# Altium schematic sheet Power_Discrete - Core.SchDoc: Power Discrete - Core
size A3; Date: Not used; ApprovedBy: Not used; CheckedBy: Not used; Author: Not used; CompanyName: STMicroelectronics; DrawnBy: Not used; Engineer: Not used; Organization: Not used; Address1: Not used; Address2: Not used; Address3: Not used; Address4: Not used; DocumentNumber: Not used; Revision: Not used; SheetNumber: 4; SheetTotal: 19; CurrentTime: Not used; CurrentDate: Not used; Time: Not used; DocumentFullPathAndName: Not used; DocumentName: Not used; ModifiedDate: Not used; ImagePath: Not used; ProjectName: Not used; Application_BuildNumber: Not used
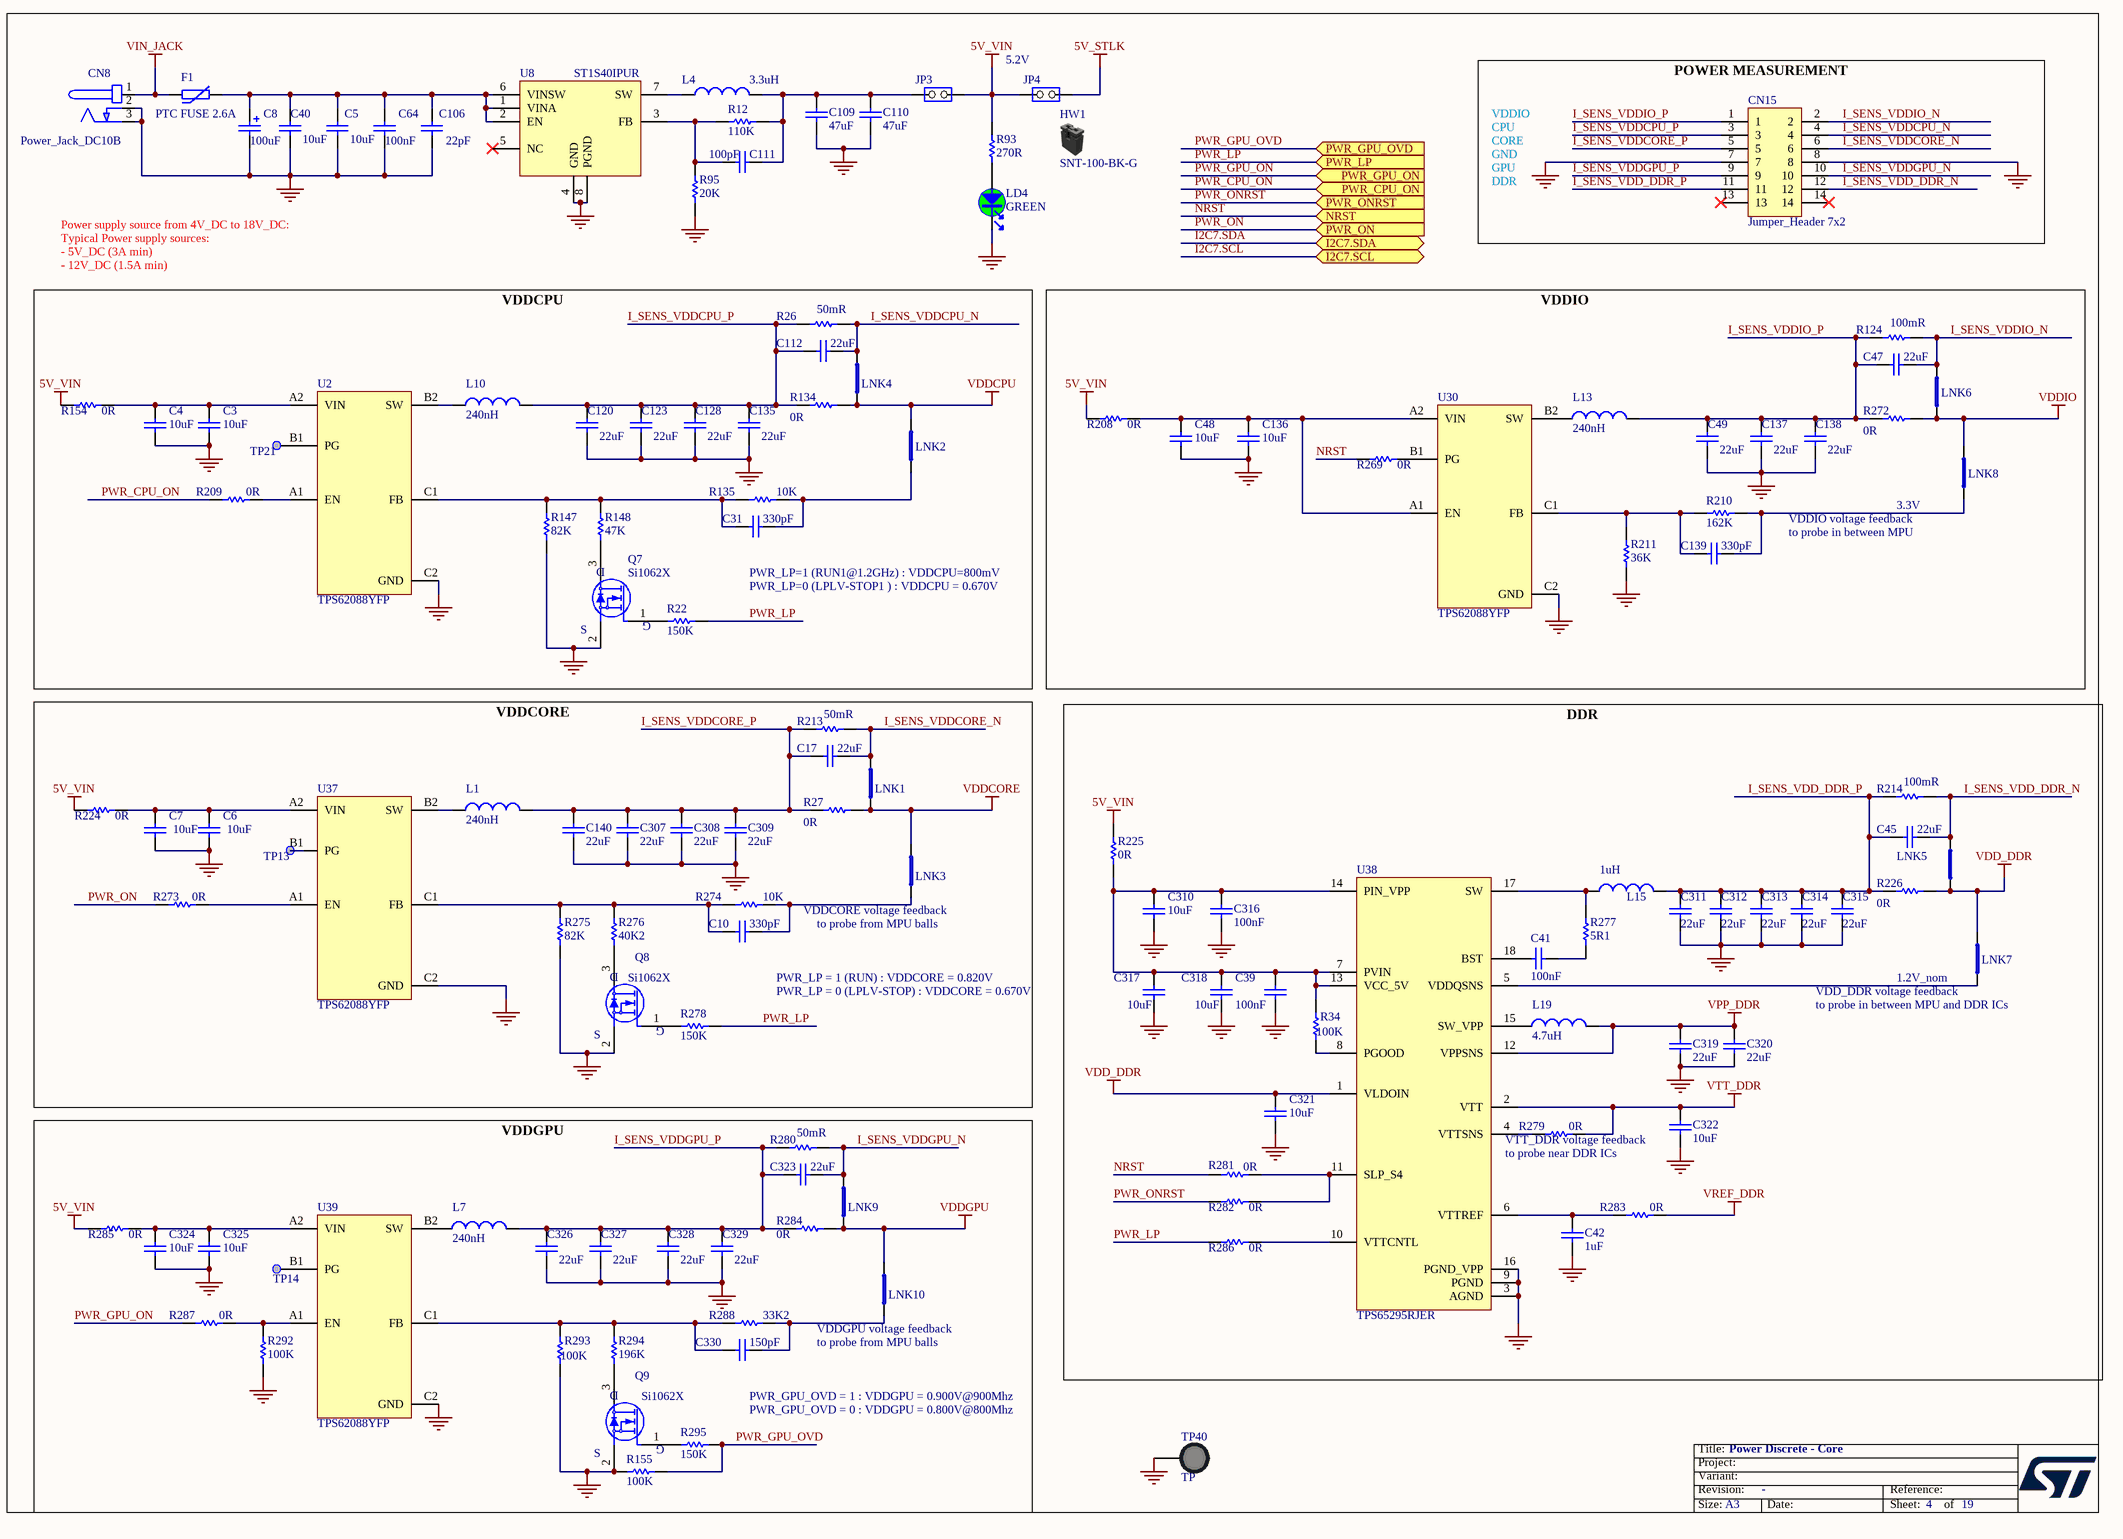
[diagram p0: Power_Discrete - Core.SchDoc]

## Parts
C3  value 10uF  [C0603]  (hidden comment: Capacitor)
C4  value 10uF  [C0603]  (hidden comment: Capacitor)
C5  value 10uF  [C0805]  (hidden comment: Capacitor)
C6  value 10uF  [C0603]  (hidden comment: Capacitor)
C7  value 10uF  [C0603]  (hidden comment: Capacitor)
C8  value 100uF  [CPOL_WURTH_WCAP-ASLL_8X10P5]  (hidden comment: Cap_POL_TANA)
C10  value 330pF  [C0402]  (hidden comment: Capacitor)
C17  value 22uF  [C0603]  (hidden comment: Capacitor)
C31  value 330pF  [C0402]  (hidden comment: Capacitor)
C39  value 100nF  [C0402]  (hidden comment: Capacitor)
C40  value 10uF  [C0805]  (hidden comment: Capacitor)
C41  value 100nF  [C0402]  (hidden comment: Capacitor)
C42  value 1uF  [C0402]  (hidden comment: Capacitor)
C45  value 22uF  [C0603]  (hidden comment: Capacitor)
C47  value 22uF  [C0603]  (hidden comment: Capacitor)
C48  value 10uF  [C0603]  (hidden comment: Capacitor)
C49  value 22uF  [C0603]  (hidden comment: Capacitor)
C64  value 100nF  [C0805_H0P85]  (hidden comment: Capacitor)
C106  value 22pF  [C0402]  (hidden comment: Capacitor)
C109  value 47uF  [C0805]  (hidden comment: Capacitor)
C110  value 47uF  [C0805]  (hidden comment: Capacitor)
C111  value 100pF  [C0402]  (hidden comment: Capacitor)
C112  value 22uF  [C0603]  (hidden comment: Capacitor)
C120  value 22uF  [C0603]  (hidden comment: Capacitor)
C123  value 22uF  [C0603]  (hidden comment: Capacitor)
C128  value 22uF  [C0603]  (hidden comment: Capacitor)
C135  value 22uF  [C0603]  (hidden comment: Capacitor)
C136  value 10uF  [C0603]  (hidden comment: Capacitor)
C137  value 22uF  [C0603]  (hidden comment: Capacitor)
C138  value 22uF  [C0603]  (hidden comment: Capacitor)
C139  value 330pF  [C0402]  (hidden comment: Capacitor)
C140  value 22uF  [C0603]  (hidden comment: Capacitor)
C307  value 22uF  [C0603]  (hidden comment: Capacitor)
C308  value 22uF  [C0603]  (hidden comment: Capacitor)
C309  value 22uF  [C0603]  (hidden comment: Capacitor)
C310  value 10uF  [C0603]  (hidden comment: Capacitor)
C311  value 22uF  [C0603]  (hidden comment: Capacitor)
C312  value 22uF  [C0603]  (hidden comment: Capacitor)
C313  value 22uF  [C0603]  (hidden comment: Capacitor)
C314  value 22uF  [C0603]  (hidden comment: Capacitor)
C315  value 22uF  [C0603]  (hidden comment: Capacitor)
C316  value 100nF  [C0402]  (hidden comment: Capacitor)
C317  value 10uF  [C0603]  (hidden comment: Capacitor)
C318  value 10uF  [C0603]  (hidden comment: Capacitor)
C319  value 22uF  [C0603]  (hidden comment: Capacitor)
C320  value 22uF  [C0603]  (hidden comment: Capacitor)
C321  value 10uF  [C0603]  (hidden comment: Capacitor)
C322  value 10uF  [C0603]  (hidden comment: Capacitor)
C323  value 22uF  [C0603]  (hidden comment: Capacitor)
C324  value 10uF  [C0603]  (hidden comment: Capacitor)
C325  value 10uF  [C0603]  (hidden comment: Capacitor)
C326  value 22uF  [C0603]  (hidden comment: Capacitor)
C327  value 22uF  [C0603]  (hidden comment: Capacitor)
C328  value 22uF  [C0603]  (hidden comment: Capacitor)
C329  value 22uF  [C0603]  (hidden comment: Capacitor)
C330  value 150pF  [C0402]  (hidden comment: Capacitor)
CN8  Power_Jack_DC10B  [CON_DC-POWER-SOCKET_CLIFF_FC68149_DC10B]
CN15  value Jumper_Header 7x2  [CON_SAMTEC_TSW-107-07-X-D]  (hidden comment: Header 7x2)
F1  value PTC FUSE 2.6A  [PTC_BEL-FUSE_1812_0ZCG0260FF2C]  (hidden comment: 0ZCG0260FF2C)
HW1  value SNT-100-BK-G  (hidden comment: Shunt Black 2.54mm)  (mechanical)
JP3  Jumper_Header 2x1  [CON_SAMTEC_TSW-102-07-G-S]  (value not drawn)
JP4  Jumper_Header 2x1  [CON_SAMTEC_TSW-102-07-G-S]  (value not drawn)
L1  value 240nH  [IND_MURATA_DFE201612P]  (hidden comment: Inductor)
L4  value 3.3uH  [IND_5040_WURTH_74404054033]  (hidden comment: Inductor)
L7  value 240nH  [IND_MURATA_DFE201612P]  (hidden comment: Inductor)
L10  value 240nH  [IND_MURATA_DFE201612P]  (hidden comment: Inductor)
L13  value 240nH  [IND_MURATA_DFE201612P]  (hidden comment: Inductor)
L15  value 1uH  [IND_4025_WURTH_74404043010A]  (hidden comment: Inductor)
L19  value 4.7uH  [IND_4025_WURTH_74404043047A]  (hidden comment: Inductor)
LD4  value GREEN  [LED_0603_OSRAM_LG-Q396-PS-35_GREEN_1A2K_H0P4]  (hidden comment: LED_green)
LNK1  link_200  [LINK200]  (value not drawn)  (no BOM)
LNK2  link_200  [LINK200]  (value not drawn)  (no BOM)
LNK3  link_200  [LINK200]  (value not drawn)  (no BOM)
LNK4  link_200  [LINK200]  (value not drawn)  (no BOM)
LNK5  link_200  [LINK200]  (value not drawn)  (no BOM)
LNK6  link_200  [LINK200]  (value not drawn)  (no BOM)
LNK7  link_200  [LINK200]  (value not drawn)  (no BOM)
LNK8  link_200  [LINK200]  (value not drawn)  (no BOM)
LNK9  link_200  [LINK200]  (value not drawn)  (no BOM)
LNK10  link_200  [LINK200]  (value not drawn)  (no BOM)
Q7  value Si1062X  [MOS_SC89-3L]  (hidden comment: MOSFET_N-CHANNEL)
Q8  value Si1062X  [MOS_SC89-3L]  (hidden comment: MOSFET_N-CHANNEL)
Q9  value Si1062X  [MOS_SC89-3L]  (hidden comment: MOSFET_N-CHANNEL)
R12  value 110K  [R0402]  (hidden comment: Resistor)
R22  value 150K  [R0402]  (hidden comment: Resistor)
R26  value 50mR  [R0603]  (hidden comment: Resistor)
R27  value 0R  [R0603]  (hidden comment: Resistor)
R34  value 100K  [R0402]  (hidden comment: Resistor)
R93  value 270R  [R0402]  (hidden comment: Resistor)
R95  value 20K  [R0402]  (hidden comment: Resistor)
R124  value 100mR  [R0603]  (hidden comment: Resistor)
R134  value 0R  [R0603]  (hidden comment: Resistor)
R135  value 10K  [R0402]  (hidden comment: Resistor)
R147  value 82K  [R0402]  (hidden comment: Resistor)
R148  value 47K  [R0402]  (hidden comment: Resistor)
R154  value 0R  [R0603]  (hidden comment: Resistor)
R155  value 100K  [R0402]  (hidden comment: Resistor)
R208  value 0R  [R0603]  (hidden comment: Resistor)
R209  value 0R  [R0402]  (hidden comment: Resistor)
R210  value 162K  [R0402]  (hidden comment: Resistor)
R211  value 36K  [R0402]  (hidden comment: Resistor)
R213  value 50mR  [R0603]  (hidden comment: Resistor)
R214  value 100mR  [R0603]  (hidden comment: Resistor)
R224  value 0R  [R0603]  (hidden comment: Resistor)
R225  value 0R  [R0603]  (hidden comment: Resistor)
R226  value 0R  [R0603]  (hidden comment: Resistor)
R269  value 0R  [R0603]  (hidden comment: Resistor)
R272  value 0R  [R0603]  (hidden comment: Resistor)
R273  value 0R  [R0402]  (hidden comment: Resistor)
R274  value 10K  [R0402]  (hidden comment: Resistor)
R275  value 82K  [R0402]  (hidden comment: Resistor)
R276  value 40K2  [R0402]  (hidden comment: Resistor)
R277  value 5R1  [R0402]  (hidden comment: Resistor)
R278  value 150K  [R0402]  (hidden comment: Resistor)
R279  value 0R  [R0402]  (hidden comment: Resistor)
R280  value 50mR  [R0603]  (hidden comment: Resistor)
R281  value 0R  [R0402]  (hidden comment: Resistor)
R282  value 0R  [R0402]  (hidden comment: Resistor)
R283  value 0R  [R0402]  (hidden comment: Resistor)
R284  value 0R  [R0603]  (hidden comment: Resistor)
R285  value 0R  [R0603]  (hidden comment: Resistor)
R286  value 0R  [R0402]  (hidden comment: Resistor)
R287  value 0R  [R0402]  (hidden comment: Resistor)
R288  value 33K2  [R0402]  (hidden comment: Resistor)
R292  value 100K  [R0402]  (hidden comment: Resistor)
R293  value 100K  [R0402]  (hidden comment: Resistor)
R294  value 196K  [R0402]  (hidden comment: Resistor)
R295  value 150K  [R0402]  (hidden comment: Resistor)
TP13  Test Point  [TP_SMD_0-6MM]  (value not drawn)  (no BOM)
TP14  Test Point  [TP_SMD_0-6MM]  (value not drawn)  (no BOM)
TP21  Test Point  [TP_SMD_0-6MM]  (value not drawn)  (no BOM)
TP40  value TP  [TP_PTH-1P02MM_TEST-TERMINAL_RS_101-2391_BLACK]  (hidden comment: Test_pin_conn_black)
U2  TPS62088YFP  [ICC_DSBGA6_YFP_0P80X1P20_H0P50_P040]
U8  ST1S40IPUR  [ICC_VFQFPN8-EPAD_4X4_P080]
U30  TPS62088YFP  [ICC_DSBGA6_YFP_0P80X1P20_H0P50_P040]
U37  TPS62088YFP  [ICC_DSBGA6_YFP_0P80X1P20_H0P50_P040]
U38  value TPS65295RJER  [ICC_VQFN18_3X3_P050]  (hidden comment: TPS65295)
U39  TPS62088YFP  [ICC_DSBGA6_YFP_0P80X1P20_H0P50_P040]

## Ports
I2C7.SCL (bidir), I2C7.SDA (bidir), NRST (in), PWR_CPU_ON (in), PWR_GPU_ON (in), PWR_GPU_OVD (in), PWR_LP (in), PWR_ON (in), PWR_ONRST (in)

## Nets
5V_STLK: JP4.1(COMMON)
5V_VIN: JP3.1(COMMON) JP4.2(NO) R93.2 R154.1 R208.1 R224.1 R225.2 R285.1
GND: C3.1 C4.1 C5.1 C6.1 C7.1 C8.2 C39.1 C40.1 C42.2 C48.1 C49.1 C64.1 C106.1 C109.1 C110.1 C120.1 C123.1 C128.1 C135.1 C136.1 C137.1 C138.1 C140.1 C307.1 C308.1 C309.1 C310.1 C311.1 C312.1 C313.1 C314.1 C315.1 C316.1 C317.1 C318.1 C319.1 C320.1 C321.1 C322.1 C324.1 C325.1 C326.1 C327.1 C328.1 C329.1 CN8.2 CN8.3 CN15.7 CN15.8 LD4.2 Q7.2(S) Q8.2(S) Q9.2(S) R95.1 R147.1 R155.2 R211.1 R275.1 R292.1 R293.1 TP40.1 U2.C2(GND) U8.4(GND) U8.8(PGND) U30.C2(GND) U37.C2(GND) U38.3(AGND) U38.9(PGND) U38.16(PGND_VPP) U39.C2(GND)
VDD_DDR: C321.2 LNK5.2 LNK7.2 R226.2 U38.1(VLDOIN)
VDDCORE: LNK1.1 LNK3.2 R27.2
VDDCPU: LNK2.1 LNK4.1 R134.2
VDDGPU: LNK9.1 LNK10.2 R284.2
VDDIO: LNK6.2 LNK8.2 R272.2
VIN_JACK: CN8.1 F1.1
VPP_DDR: C319.2 C320.2 L19.2 U38.12(VPPSNS)
VREF_DDR: R283.2
VTT_DDR: C322.2 R279.2 U38.2(VTT)
I2C7.SCL: port I2C7.SCL
I2C7.SDA: port I2C7.SDA
I_SENS_VDD_DDR_N: C45.1 CN15.12 LNK5.1 R214.2
I_SENS_VDD_DDR_P: C45.2 C311.2 C312.2 C313.2 C314.2 C315.2 CN15.11 L15.2 R214.1 R226.1
I_SENS_VDDCORE_N: C17.1 CN15.6 LNK1.2 R213.2
I_SENS_VDDCORE_P: C17.2 C140.2 C307.2 C308.2 C309.2 CN15.5 L1.2 R27.1 R213.1
I_SENS_VDDCPU_N: C112.1 CN15.4 LNK4.2 R26.2
I_SENS_VDDCPU_P: C112.2 C120.2 C123.2 C128.2 C135.2 CN15.3 L10.2 R26.1 R134.1
I_SENS_VDDGPU_N: C323.1 CN15.10 LNK9.2 R280.2
I_SENS_VDDGPU_P: C323.2 C326.2 C327.2 C328.2 C329.2 CN15.9 L7.2 R280.1 R284.1
I_SENS_VDDIO_N: C47.1 CN15.2 LNK6.1 R124.2
I_SENS_VDDIO_P: C47.2 C49.2 C137.2 C138.2 CN15.1 L13.2 R124.1 R272.1
NRST: R269.1 R281.1 ; port NRST
PWR_CPU_ON: R209.1 ; port PWR_CPU_ON
PWR_GPU_ON: R287.1 ; port PWR_GPU_ON
PWR_GPU_OVD: R155.1 R295.1 ; port PWR_GPU_OVD
PWR_LP: R22.1 R278.1 R286.1 ; port PWR_LP
PWR_ON: R273.1 ; port PWR_ON
PWR_ONRST: R282.1 ; port PWR_ONRST
NetC3_2: C3.2 C4.2 R154.2 U2.A2(VIN)
NetC5_2: C5.2 C8.1 C40.2 C64.2 C106.2 F1.2 U8.1(VINA) U8.2(EN) U8.6(VINSW)
NetC6_2: C6.2 C7.2 R224.2 U37.A2(VIN)
NetC10_1: C10.1 R274.1 R275.2 R276.2 U37.C1(FB)
NetC10_2: C10.2 LNK3.1 R274.2
NetC31_1: C31.1 R135.1 R147.2 R148.2 U2.C1(FB)
NetC31_2: C31.2 LNK2.2 R135.2
NetC39_2: C39.2 C310.2 C316.2 C317.2 C318.2 R34.2 R225.1 U38.7(PVIN) U38.13(VCC_5V) U38.14(PIN_VPP)
NetC41_1: C41.1 U38.18(BST)
NetC41_2: C41.2 R277.1
NetC42_1: C42.1 R283.1 U38.6(VTTREF)
NetC48_2: C48.2 C136.2 R208.2 U30.A1(EN) U30.A2(VIN)
NetC109_2: C109.2 C110.2 C111.1 JP3.2(NO) L4.2 R12.1
NetC111_2: C111.2 R12.2 R95.2 U8.3(FB)
NetC139_1: C139.1 R210.1 R211.2 U30.C1(FB)
NetC139_2: C139.2 LNK8.1 R210.2
NetC324_2: C324.2 C325.2 R285.2 U39.A2(VIN)
NetC330_1: C330.1 R288.1 R293.2 R294.2 U39.C1(FB)
NetC330_2: C330.2 LNK10.1 R288.2
NetL1_1: L1.1 U37.B2(SW)
NetL4_1: L4.1 U8.7(SW)
NetL7_1: L7.1 U39.B2(SW)
NetL10_1: L10.1 U2.B2(SW)
NetL13_1: L13.1 U30.B2(SW)
NetL15_1: L15.1 R277.2 U38.17(SW)
NetL19_1: L19.1 U38.15(SW_VPP)
NetLD4_1: LD4.1 R93.1
NetLNK7_1: LNK7.1 U38.5(VDDQSNS)
NetQ7_1: Q7.1(G) R22.2
NetQ7_3: Q7.3(D) R148.1
NetQ8_1: Q8.1(G) R278.2
NetQ8_3: Q8.3(D) R276.1
NetQ9_1: Q9.1(G) R295.2
NetQ9_3: Q9.3(D) R294.1
NetR34_1: R34.1 U38.8(PGOOD)
NetR209_2: R209.2 U2.A1(EN)
NetR269_2: R269.2 U30.B1(PG)
NetR273_2: R273.2 U37.A1(EN)
NetR279_1: R279.1 U38.4(VTTSNS)
NetR281_2: R281.2 R282.2 U38.11(SLP_S4)
NetR286_2: R286.2 U38.10(VTTCNTL)
NetR287_2: R287.2 R292.2 U39.A1(EN)
NetTP13_1: TP13.1 U37.B1(PG)
NetTP14_1: TP14.1 U39.B1(PG)
NetTP21_1: TP21.1 U2.B1(PG)

Not connected (* = marked no-connect by the designer): CN15 13* 14*; U8 5(NC)*

## Notes on the sheet
- (near JP4) 5.2V
- VDDIO
- CPU
- GND
- DDR
- CORE
- GPU
- (near CN15) POWER MEASUREMENT
- Power supply source from 4V_DC to 18V_DC:
  Typical Power supply sources:
  - 5V_DC (3A min)
  - 12V_DC (1.5A min)
- VDDIO voltage feedback
- (near LNK8) 3.3V
- (near C31) PWR_LP=1 (RUN1@1.2GHz) : VDDCPU=800mV
- PWR_LP=0 (LPLV-STOP1 ) : VDDCPU = 0.670V
- to probe in between MPU
- VDDCPU
- (near LNK3) VDDCORE voltage feedback
- (near LNK3) to probe from MPU balls
- PWR_LP = 1 (RUN) : VDDCORE = 0.820V
- PWR_LP = 0 (LPLV-STOP) : VDDCORE = 0.670V
- (near LNK7) VDD_DDR voltage feedback
- (near LNK7) 1.2V_nom
- (near LNK7) to probe in between MPU and DDR ICs
- VDDCORE
- (near R279) VTT_DDR voltage feedback
- to probe near DDR ICs
- (near LNK10) VDDGPU voltage feedback
- PWR_GPU_OVD = 1 : VDDGPU = 0.900V@900Mhz
- (near LNK10) to probe from MPU balls
- PWR_GPU_OVD = 0 : VDDGPU = 0.800V@800Mhz
- VDDGPU
- Title:
- Project:
- Size:
- Revision:
- Variant:
- A3
- -
- Date:
- Reference:
- Sheet:
- of

## Library data of the parts
C3 C4 C6 C7 C48 C136 C310 C317 C318 C321 C322 C324 C325 = MCD-00099: Capacitor, MLCC, 10uF, 10V, X5R, +/-10%, 0603, T=0,8mm; Manufacturer_Part_Number: GRM188R61A106KE69D; Manufacturer: MURATA; Part_Preference: Recommended; Order_Code_RS: 170-6168; ID: 2770; ShowFields: YES; Internal_Part_Number: MCD-00099; Status: Released; Part_Type: Capacitor; Package: 0603; ComponentLink1Description: Part_Information; ComponentLink1URL: http://tunmcdsvn.tun.st.com/Component_Documentation_Library/Trunk/Capacitor/MURATA_GRM_Series; Order_Code_Digikey: 490-10474-1-ND; Order_Code_Farnell: 2494233; Alternate_Manufacturer: N/A; Alternate_Manufacturer_Part_Number: N/A
C5 C40 = MCD-00014: Capacitor, MLCC, 10uF, 25V, X5R, +/-10%, 0805, T=0,85mm; Part_Preference: Recommended; Manufacturer: YAGEO; Manufacturer_Part_Number: CC0805KRX5R8BB106; Full_Alternate_Internal_Part_Number: MCD-02385; ID: 2468; ShowFields: YES; Internal_Part_Number: MCD-00014; Status: Released; Part_Type: Capacitor; Package: 0805; ComponentLink1Description: Part_Information; ComponentLink1URL: http://tunmcdsvn.tun.st.com/Component_Documentation_Library/Trunk/Capacitor/YAGEO_X5R_Series; Order_Code_Digikey: 311-3503-1-ND; Order_Code_Farnell: N/A; Order_Code_RS: N/A; Alternate_Manufacturer: N/A; Alternate_Manufacturer_Part_Number: N/A
C8 = MCD-01683: Capacitor,Electrolytic,100uF,35V, 20%, SMT, D=8mm, T=10.5mm; Part_Preference: Recommended; Manufacturer: WURTH ELEKTRONIK; Manufacturer_Part_Number: 865060553006; Order_Code_RS: 839-5753; ID: 3783; ShowFields: YES; Revision: July-2002: Re-released for DXP Platform.; Internal_Part_Number: MCD-01683; Status: Released; Part_Type: Capacitor; Package: 8x10.5mm; ComponentLink1Description: Part_Information; ComponentLink1URL: http://tunmcdsvn.tun.st.com/Component_Documentation_Library/Trunk/Capacitor/WURTH-ELEKTRONIC_ASLL_Series; Order_Code_Digikey: 732-8586-1-ND; Order_Code_Farnell: 2466219; Alternate_Manufacturer: N/A; Alternate_Manufacturer_Part_Number: N/A
C10 C31 C139 = MCD-01579: Capacitor, MLCC, 330pF, 50V, NPO, +/-5%, 0402, T=0.5mm; Part_Preference: Recommended; Manufacturer: YAGEO; Manufacturer_Part_Number: CC0402JRNPO9BN331; ID: 3679; ShowFields: YES; Internal_Part_Number: MCD-01579; Status: Checked; Part_Type: Capacitor; Alternate_Manufacturer: N/A; Alternate_Manufacturer_Part_Number: N/A; Package: 0402; ComponentLink1URL: http://tunmcdsvn.tun.st.com/Component_Documentation_Library/Trunk/Capacitor/YAGEO_NP0_Series; Order_Code_Digikey: 311-1667-1-ND; Order_Code_Farnell: N/A; Order_Code_RS: N/A
C17 C45 C47 C49 C112 C120 C123 C128 C135 C137 C138 C308 C309 C311-C315 C319 C320 C323 C326-C329 = MCD-00100: Capacitor, MLCC, 22uF, 6V3, X5R, +/-20%, 0603, T=0,8mm; Manufacturer_Part_Number: GRM188R60J226MEA0J; Manufacturer: MURATA; Part_Preference: Recommended; ID: 2766; ShowFields: YES; Internal_Part_Number: MCD-00100; Status: Released; Part_Type: Capacitor; Package: 0603; ComponentLink1Description: Part_Information; ComponentLink1URL: http://tunmcdsvn.tun.st.com/Component_Documentation_Library/Trunk/Capacitor/MURATA_GRM_Series; Order_Code_Digikey: 490-7612-2-ND; Order_Code_Farnell: N/A; Order_Code_RS: N/A; Alternate_Manufacturer: N/A; Alternate_Manufacturer_Part_Number: N/A
C39 C41 C316 = MCD-00006: Capacitor, MLCC, 100nF, 16V, X7R, +/-10%, 0402, T=0.5mm; Part_Preference: Recommended; Manufacturer: YAGEO; Manufacturer_Part_Number: CC0402KRX7R7BB104; Alternate_Manufacturer: MURATA; Alternate_Manufacturer_Part_Number: GCM155R71C104KA55D; Order_Code_RS: 616-9701; ID: 2474; ShowFields: YES; Internal_Part_Number: MCD-00006; Status: Released; Part_Type: Capacitor; Package: 0402; ComponentLink1URL: http://tunmcdsvn.tun.st.com/Component_Documentation_Library/Trunk/Capacitor/YAGEO_X7R_Series; Order_Code_Digikey: 311-1338-1-ND; Order_Code_Farnell: 9402047
C42 = MCD-01722: Capacitor, MLCC, 1uF, 10V, X5R, +/-10%, 0402, T=0.5mm; Part_Preference: Recommended; Manufacturer: YAGEO; Manufacturer_Part_Number: CC0402KRX5R6BB105; ID: 3822; ShowFields: YES; Internal_Part_Number: MCD-01722; Status: Released; Part_Type: Capacitor; Alternate_Manufacturer: N/A; Alternate_Manufacturer_Part_Number: N/A; Package: 0402; ComponentLink1URL: http://tunmcdsvn.tun.st.com/Component_Documentation_Library/Trunk/Capacitor/YAGEO_X5R_Series; Order_Code_Digikey: 311-1439-1-ND; Order_Code_Farnell: 1458896; Order_Code_RS: N/A
C64 = MCD-01525: Capacitor, MLCC, 100nF, 50V, X7R, 10%, 0805, T=0,85mm; BMS_Part_Number: 9142249; Part_Preference: Recommended; Manufacturer: YAGEO; Manufacturer_Part_Number: CC0805KRX7R9BB104; Order_Code_RS: 669-8842; ID: 3625; ShowFields: YES; Internal_Part_Number: MCD-01525; Status: Released; Part_Type: Capacitor; Package: 0805; ComponentLink1Description: Part_Information; ComponentLink1URL: http://tunmcdsvn.tun.st.com/Component_Documentation_Library/Trunk/Capacitor/YAGEO_X7R_Series; Order_Code_Digikey: 311-1140-1-ND; Order_Code_Farnell: 3019949; Alternate_Manufacturer: N/A; Alternate_Manufacturer_Part_Number: N/A
C106 = MCD-01995: Capacitor, MLCC, 22pF, 50V, C0G, 5%, 0402, T=0,5mm; Part_Preference: Recommended; Manufacturer: TDK; Manufacturer_Part_Number: C1005NP01H220J050BA; ID: 4095; ShowFields: YES; Internal_Part_Number: MCD-01995; Status: Released; Part_Type: Capacitor; Package: 0402; ComponentLink1Description: Part_Information; ComponentLink1URL: http://tunmcdsvn.tun.st.com/Component_Documentation_Library/Trunk/Capacitor/TDK_C_Series; Order_Code_Digikey: 445-13793-1-ND; Alternate_Manufacturer: N/A; Alternate_Manufacturer_Part_Number: N/A; Order_Code_Farnell: 3416050RL; Order_Code_RS: N/A
C109 C110 = MCD-00204: Capacitor, MLCC, 47uF, 10V, X5R, +/-20%, 0805, T=1,25mm; Part_Preference: Recommended; Manufacturer: MURATA; Manufacturer_Part_Number: GRM21BR61A476ME15K; ID: 2664; ShowFields: YES; Internal_Part_Number: MCD-00204; Status: Checked; Part_Type: Capacitor; Alternate_Manufacturer: N/A; Alternate_Manufacturer_Part_Number: N/A; Package: 0805; ComponentLink1Description: Part_Information; ComponentLink1URL: http://tunmcdsvn.tun.st.com/Component_Documentation_Library/Trunk/Capacitor/MURATA_GRM_Series; Order_Code_Digikey: GRM21BR61A476ME15K-ND; Order_Code_Farnell: N/A; Order_Code_RS: N/A
C111 = MCD-00205: Capacitor,MLCC,100pF,50V,NPO,+/-5%,0402,T=0,5mm; Manufacturer_Part_Number: CC0402JRNPO9BN101; Manufacturer: YAGEO; Part_Preference: Recommended; Fitted: YES; ID: 2658; Internal_Part_Number: MCD-00205; Status: Released; Part_Type: Capacitor; Package: 0402; ComponentLink1Description: Part_Information; ComponentLink1URL: http://tunmcdsvn.tun.st.com/Component_Documentation_Library/Trunk/Capacitor/YAGEO_NP0_Series; Order_Code_Digikey: 311-1024-1-ND; Order_Code_Farnell: 3019226RL; Order_Code_RS: N/A; Alternate_Manufacturer: N/A; Alternate_Manufacturer_Part_Number: N/A; ShowFields: YES
C140 C307 = MCD-00100: Capacitor, MLCC, 22uF, 6V3, X5R, +/-20%, 0603, T=0,8mm; Part_Preference: Recommended; Manufacturer: MURATA; Manufacturer_Part_Number: GRM188R60J226MEA0J; ID: 2766; ShowFields: YES; Internal_Part_Number: MCD-00100; Status: Released; Part_Type: Capacitor; Package: 0603; ComponentLink1URL: http://tunmcdsvn.tun.st.com/Component_Documentation_Library/Trunk/Capacitor/MURATA_GRM_Series; Order_Code_Digikey: 490-7612-2-ND; Order_Code_Farnell: N/A; Order_Code_RS: N/A; ComponentLink1Description: Part_Information; Alternate_Manufacturer: N/A; Alternate_Manufacturer_Part_Number: N/A
C330 = MCD-00672: Capacitor, MLCC, 150pF, 50V, NPO, +/-5%, 0402, T=0.5mm; Part_Preference: Recommended; Manufacturer: YAGEO; Manufacturer_Part_Number: CC0402JRNPO9BN151; ID: 3069; ShowFields: YES; Internal_Part_Number: MCD-00672; Status: Released; Part_Type: Capacitor; Alternate_Manufacturer: N/A; Alternate_Manufacturer_Part_Number: N/A; Package: 0402; ComponentLink1URL: http://tunmcdsvn.tun.st.com/Component_Documentation_Library/Trunk/Capacitor/YAGEO_NP0_Series; Order_Code_Digikey: 311-1025-1-ND; Order_Code_Farnell: 3019238; Order_Code_RS: N/A
CN8 = MCD-00173: DC-Power-Jack, 2.5mm, 5A, RA, TH; BMS_Part_Number: 9087803; Part_Preference: Recommended; Part_Type: Connector; Manufacturer: CLIFF; Manufacturer_Part_Number: DC10B; Value: Jack_DC-Power_DC10B; ID: 2695; ShowFields: YES; Internal_Part_Number: MCD-00173; Status: Released; ComponentLink1Description: Part_Information; ComponentLink1URL: http://tunmcdsvn.tun.st.com/Component_Documentation_Library/Trunk/Connector/CLIFF_DC_Series/; Alternate_Manufacturer: N/A; Alternate_Manufacturer_Part_Number: N/A; Order_Code_Digikey: N/A; Order_Code_Farnell: 224960; Order_Code_RS: N/A
CN15 = MCD-02123: Header, 7x2, 2,54mm, VR, TH, Height 5.84mm/2.54mm; Part_Type: Connector; Part_Preference: Recommended; Manufacturer: SAMTEC; Manufacturer_Part_Number: TSW-107-07-G-D; ID: 4223; ShowFields: YES; Internal_Part_Number: MCD-02123; Status: Checked; Alternate_Manufacturer: N/A; Alternate_Manufacturer_Part_Number: N/A; ComponentLink1URL: http://tunmcdsvn.tun.st.com/Component_Documentation_Library/Trunk/Connector/SAMTEC_TSW_Series/; Order_Code_Digikey: N/A; Order_Code_Farnell: N/A; Order_Code_RS: N/A; ComponentLink1Description: Part_Information
F1 = MCD-00624: SMD, PTC resettable fuse, IH:2.6A, IT:5A, Vdc_max:8V, Rmax:47mohm, BELFUSE; Part_Preference: Recommended; Part_Type: Misc; ID: 3118; ShowFields: YES; Internal_Part_Number: MCD-00624; Status: Checked; Manufacturer: BELFUSE; Manufacturer_Part_Number: 0ZCG0260FF2C; ComponentLink1Description: Part_Information; ComponentLink1URL: http://tunmcdsvn.tun.st.com/Component_Datasheet_Library/Trunk/Misc/BELFUSE_FUSE_PTC_0ZCG_series
HW1 = MCD-00043: SHUNT 2.54mm BLACK; Part_Type: Misc; Part_Preference: Recommended; Manufacturer: SAMTEC; Full_Alternate_Internal_Part_Number: MCD-02388; ShowFields: YES; ID: 2551; Internal_Part_Number: MCD-00043; Status: Released; Manufacturer_Part_Number: SNT-100-BK-G; ComponentLink1URL: http://tunmcdsvn.tun.st.com/Component_Datasheet_Library/Trunk/Connectors/Samtec_Shunt_Jumper_SNT100
JP3 JP4 = MCD-00045: Header, 2x1, 2.54mm, VR, TH, T=5.84mm/2.54mm; Part_Preference: Recommended; Part_Type: Connector; Manufacturer: SAMTEC; Manufacturer_Part_Number: TSW-102-07-G-S; Alternate_Internal_Part_Number: MCD-02390; Order_Code_RS: 155-5312; ShowFields: YES; ID: 2545; Internal_Part_Number: MCD-00045; Status: Released; ComponentLink1URL: http://tunmcdsvn.tun.st.com/Component_Documentation_Library/Trunk/Connector/SAMTEC_TSW_Series/; Value: Header 2x1; Order_Code_Digikey: SAM1029-02-ND; Order_Code_Farnell: 2505044; Full_Alternate_Internal_Part_Number: MCD-02390
L1 L7 L10 L13 = MCD-02477: Inductor, 240nH, +/-20%, 4.4A, 23mR, 0806, T=1.2mm; Part_Preference: Recommended; Manufacturer: MURATA; Manufacturer_Part_Number: DFE201612P-R24M=P2; Alternate_Manufacturer_Part_Number: DFE201612E-R24M=P2; Order_Code_RS: 167-0599; ID: 4583; ShowFields: YES; Internal_Part_Number: MCD-02477; Status: Released; Part_Type: Inductor; Alternate_Manufacturer: MURATA; Package: 0806; ComponentLink1URL: http://tunmcdsvn.tun.st.com/Component_Documentation_Library/Trunk/Inductor/MURATA_DFE201612P_Series/; Order_Code_Digikey: 490-10621-2-ND; Order_Code_Farnell: 2530051; ComponentLink1Description: Part_Information
L4 = MCD-02220: Fixed Inductors WE-LQS 5040 3.3uH 3.4A 24mOhm; Part_Preference: Recommended; Manufacturer: WURTH ELEKTRONIK; Manufacturer_Part_Number: 74404054033; Order_Code_RS: 814-2571; ID: 4320; ShowFields: YES; Internal_Part_Number: MCD-02220; Status: Checked; Part_Type: Inductor; Package: 5040; ComponentLink1Description: Part_Information; ComponentLink1URL: http://tunmcdsvn.tun.st.com/Component_Documentation_Library/Trunk/Inductor/WURTH_ELEKTRONIK_74404054033; Alternate_Manufacturer: N/A; Alternate_Manufacturer_Part_Number: N/A; Order_Code_Digikey: 732-5516-1-ND; Order_Code_Farnell: 2431504
L15 = MCD-01555: SMD Power Inductors WE-LQS 1uH 4.9A 14mOhms; Manufacturer_Part_Number: 74404043010A; Manufacturer: WURTH ELEKTRONIK; Part_Preference: Recommended; ID: 3655; ShowFields: YES; Internal_Part_Number: MCD-01555; Status: Checked; Part_Type: Inductor; Package: 4x4mm; ComponentLink1Description: Part_Information; ComponentLink1URL: http://tunmcdsvn.tun.st.com/Component_Documentation_Library/Trunk/Inductor/WURTH_ELEKTRONIK_74404043010A; Alternate_Manufacturer: N/A; Alternate_Manufacturer_Part_Number: N/A; Order_Code_Digikey: 732-10753-1-ND; Order_Code_Farnell: 2749068; Order_Code_RS: N/A
L19 = MCD-02490: Inductor, 4.7uH, +/-20%, 4.9A, 0R014, 4x4mm, T=2.5mm; Part_Preference: Recommended; Manufacturer: WURTH ELEKTRONIK; Manufacturer_Part_Number: 74404043047A; Order_Code_RS: 135-4773; ID: 4596; ShowFields: YES; Internal_Part_Number: MCD-02490; Status: Checked; Part_Type: Inductor; Alternate_Manufacturer: N/A; Alternate_Manufacturer_Part_Number: N/A; Package: 4x4mm; ComponentLink1URL: http://tunmcdsvn.tun.st.com/Component_Documentation_Library/Trunk/Inductor/WURTH_ELEKTRONIK_74404043047A; Order_Code_Digikey: 732-10756-2-ND; Order_Code_Farnell: 2749071
LD4 = MCD-00588: LED Green, 0603 SMD, Forward Voltage Typ=2V, Max=2.5V; Part_Type: Display; Manufacturer_Part_Number: LG Q396-PS-35; Manufacturer: OSRAM OPTO SEMICONDUCTORS; Alternate_Manufacturer_Part_Number: VLMTG1300-GS08; Alternate_Manufacturer: VISHAY SEMICONDUCTOR OPTO DIVISION; Alternate_Internal_Part_Number: MCD-02400; Part_Preference: Recommended; Provided_By: SUBCO; ID: 3155; ShowFields: YES; Internal_Part_Number: MCD-00588; Status: Released; Package: LED 0603; ComponentLink1Description: Datasheet; ComponentLink1URL: http://tunmcdsvn.tun.st.com/Component_Datasheet_Library/Trunk/Display/OSRAM_LED_GREEN_LG Q396-PS-35; Order_Code_Digikey: LG Q396-PS-35-ND; ECCN_US: n/a; ECCN_EU: n/a; Full_Alternate_Internal_Part_Number: MCD-02400
LNK1-LNK10 = link_200: link 0.2mm; Value: link_200
Q7-Q9 = MCD-02221: MOSFET N-CH 20V SC-89; Part_Preference: Recommended; Part_Type: Transistor; Manufacturer: VISHAY; Order_Code_RS: 812-3044; ID: 4321; ShowFields: YES; Internal_Part_Number: MCD-02221; Status: Checked; Manufacturer_Part_Number: Si1062X; Package: SC-89; ComponentLink1Description: Part_Information; ComponentLink1URL: http://tunmcdsvn.tun.st.com/Component_Datasheet_Library/Trunk/Transistors/VISHAY_Si1062X; Alternate_Manufacturer: N/A; Alternate_Manufacturer_Part_Number: N/A; Order_Code_Digikey: SI1062X-T1-GE3CT-ND; Order_Code_Farnell: 2646363
R12 = MCD-00367: Resistor,110K,0402,1%,1/16W; Manufacturer_Part_Number: RC0402FR-07110KL; Manufacturer: YAGEO; Part_Preference: Recommended; ID: 2912; ShowFields: YES; Internal_Part_Number: MCD-00367; Status: Released; Part_Type: Resistor; Package: 0402; ComponentLink1Description: Part_Information; ComponentLink1URL: http://tunmcdsvn.tun.st.com/Component_Documentation_Library/Trunk/Resistor/YAGEO_RC_L_Series; Order_Code_Digikey: 311-110KLRCT-ND; Order_Code_Farnell: 1458740; Order_Code_RS: N/A; Alternate_Manufacturer: N/A; Alternate_Manufacturer_Part_Number: N/A
R22 R278 R295 = MCD-00165: Resistor,150K,0402,1%,1/16W; Manufacturer_Part_Number: RC0402FR-07150KL; Manufacturer: YAGEO; BMS_Part_Number: 9131032; Part_Preference: Recommended; ID: 2702; ShowFields: YES; Internal_Part_Number: MCD-00165; Status: Checked; Part_Type: Resistor; Package: 0402; ComponentLink1Description: Part_Information; ComponentLink1URL: http://tunmcdsvn.tun.st.com/Component_Documentation_Library/Trunk/Resistor/YAGEO_RC_L_Series; Order_Code_Digikey: 311-150KLRCT-ND; Order_Code_Farnell: 9239499; Order_Code_RS: N/A; Alternate_Manufacturer: N/A; Alternate_Manufacturer_Part_Number: N/A
R26 R213 R280 = MCD-02233: Resistor,50moHm,0603,1%,1/3W, T=0.55mm; Part_Preference: Recommended; Manufacturer: PANASONIC; Manufacturer_Part_Number: ERJ-3BWFR050V; Order_Code_RS: RA; ID: 4333; ShowFields: YES; Internal_Part_Number: MCD-02233; Status: Checked; Part_Type: Resistor; Alternate_Manufacturer: N/A; Alternate_Manufacturer_Part_Number: N/A; Package: 0603; ComponentLink1Description: Part_Information; ComponentLink1URL: http://tunmcdsvn.tun.st.com/Component_Documentation_Library/Trunk/Resistor/PANASONIC_ERJ_Series; Order_Code_Digikey: ERJ-3BWFR050V; Order_Code_Farnell: 2493026
R27 R134 R226 R272 R284 = MCD-00181: Resistor,0R,0603,ULO; Manufacturer_Part_Number: PMR03EZPJ000; Manufacturer: ROHM; Part_Preference: Recommended; Provided_By: SUBCO; ID: 2691; ShowFields: YES; Internal_Part_Number: MCD-00181; Status: Released; Part_Type: Resistor; Package: 0603; ComponentLink1Description: Part_Information; ComponentLink1URL: http://tunmcdsvn.tun.st.com/Component_Documentation_Library/Trunk/Resistor/ROHM_PMR_Series; Order_Code_Digikey: PMR03EZPJ000-ND; Order_Code_Farnell: N/A; Order_Code_RS: N/A; Alternate_Manufacturer: N/A; Alternate_Manufacturer_Part_Number: N/A
R34 = MCD-00059: Resistor,100K,0402,1%,1/16W; Part_Preference: Recommended; Manufacturer: YAGEO; Manufacturer_Part_Number: RC0402FR-07100KL; Alternate_Manufacturer_Part_Number: RT0402FRE07100KL; ID: 2533; ShowFields: YES; Internal_Part_Number: MCD-00059; Status: Released; Part_Type: Resistor; Alternate_Manufacturer: YAGEO; Package: 0402; ComponentLink1URL: http://tunmcdsvn.tun.st.com/Component_Documentation_Library/Trunk/Resistor/YAGEO_RC_L_Series; Order_Code_Digikey: 311-100KLRTR-ND; Order_Code_Farnell: 2421891; Order_Code_RS: N/A; ComponentLink1Description: Part_Information
R93 = MCD-00441: Resistor,270R,0402,1%,1/16W; Manufacturer_Part_Number: RC0402FR-07270RL; Manufacturer: YAGEO; Part_Preference: Recommended; Provided_By: SUBCO; ECCN_US: EAR99; ECCN_EU: NEC; ID: 2838; ShowFields: YES; Internal_Part_Number: MCD-00441; Status: Released; Part_Type: Resistor; Package: 0402; ComponentLink1Description: Datasheet; ComponentLink1URL: http://tunmcdsvn.tun.st.com/Component_Documentation_Library/Trunk/Resistor/YAGEO_RC_L_Series; Order_Code_Digikey: 311-270LRCT-ND; Order_Code_Farnell: 9239162; Order_Code_RS: N/A
R95 = MCD-00421: Resistor,20K,0402,1%,1/16W; Part_Preference: Recommended; Manufacturer: YAGEO; Manufacturer_Part_Number: RC0402FR-0720KL; ID: 2858; ShowFields: YES; Internal_Part_Number: MCD-00421; Status: Released; Part_Type: Resistor; Package: 0402; ComponentLink1Description: Part_Information; ComponentLink1URL: http://tunmcdsvn.tun.st.com/Component_Documentation_Library/Trunk/Resistor/YAGEO_RC_L_Series; Order_Code_Digikey: 311-20.0KLRCT-ND; Order_Code_Farnell: 1799191; Order_Code_RS: N/A; Alternate_Manufacturer: N/A; Alternate_Manufacturer_Part_Number: N/A
R124 R214 = MCD-02234: Resistor,100moHm,0603,1%,1/3W; Part_Preference: Recommended; Manufacturer: PANASONIC; Manufacturer_Part_Number: ERJ-3BWFR100V; Order_Code_RS: 763-8731; ID: 4334; ShowFields: YES; Internal_Part_Number: MCD-02234; Status: Checked; Part_Type: Resistor; Alternate_Manufacturer: N/A; Alternate_Manufacturer_Part_Number: N/A; Package: 0603; ComponentLink1Description: Part_Information; ComponentLink1URL: http://tunmcdsvn.tun.st.com/Component_Documentation_Library/Trunk/Resistor/PANASONIC_ERJ_Series; Order_Code_Digikey: P17478CT-ND; Order_Code_Farnell: 1798596
R135 R274 = MCD-00053: Resistor,10K,0402,1%,1/16W; BMS_Part_Number: 9131590; Part_Preference: Recommended; Manufacturer: YAGEO; Manufacturer_Part_Number: RC0402FR-0710KL; ID: 2539; ShowFields: YES; Internal_Part_Number: MCD-00053; Status: Released; Part_Type: Resistor; Package: 0402; ComponentLink1URL: http://tunmcdsvn.tun.st.com/Component_Documentation_Library/Trunk/Resistor/YAGEO_RC_L_Series; Order_Code_Digikey: 311-10.0KLRCT-ND; Order_Code_Farnell: 9239359; Order_Code_RS: N/A; ComponentLink1Description: Part_Information; Alternate_Manufacturer: N/A; Alternate_Manufacturer_Part_Number: N/A
R147 R275 = MCD-00531: Resistor, 82K, 0402, +/-1%, 1/16W; Part_Preference: Recommended; Manufacturer: YAGEO; Manufacturer_Part_Number: RC0402FR-0782KL; ID: 3207; ShowFields: YES; Internal_Part_Number: MCD-00531; Status: Released; Part_Type: Resistor; Alternate_Manufacturer: N/A; Alternate_Manufacturer_Part_Number: N/A; Package: 0402; ComponentLink1URL: http://tunmcdsvn.tun.st.com/Component_Documentation_Library/Trunk/Resistor/YAGEO_RC_L_Series; Order_Code_Digikey: 311-82.0KLRCT-ND; Order_Code_Farnell: 9239464; Order_Code_RS: N/A; ComponentLink1Description: Part_Information
R148 = MCD-00063: Resistor, 47K, 0402, +/-1%, 1/16W; Part_Preference: Recommended; Manufacturer: YAGEO; Manufacturer_Part_Number: RC0402FR-0747KL; Component_Country_Of_Origin: China; ShowFields: YES; ID: 2528; Internal_Part_Number: MCD-00063; Status: Released; Part_Type: Resistor; Package: 0402; ComponentLink1URL: http://tunmcdsvn.tun.st.com/Component_Documentation_Library/Trunk/Resistor/YAGEO_RC_L_Series; Order_Code_Digikey: 311-47.0KLRCT-ND; Order_Code_Farnell: 9239430; Order_Code_RS: N/A
R154 R208 R224 R225 R269 R285 = MCD-00056: Resistor,0R,0603,5%,1/10W; Manufacturer_Part_Number: RC0603JR-070RL; Manufacturer: YAGEO; Part_Preference: Recommended; ID: 2536; ShowFields: YES; Internal_Part_Number: MCD-00056; ComponentLink1Description: Part_Information; Status: Released; Part_Type: Resistor; ComponentLink1URL: http://tunmcdsvn.tun.st.com/Component_Documentation_Library/Trunk/Resistor/YAGEO_RC_L_Series; Package: 0603; Order_Code_Digikey: 311-0.0GRCT-ND; Order_Code_Farnell: 9233130RL; Order_Code_RS: N/A; Alternate_Manufacturer: N/A; Alternate_Manufacturer_Part_Number: N/A
R155 R292 R293 = MCD-00059: Resistor, 100K, 0402, +/-1%, 1/16W; Part_Preference: Recommended; Manufacturer: YAGEO; Manufacturer_Part_Number: RC0402FR-07100KL; Alternate_Manufacturer_Part_Number: RT0402FRE07100KL; ID: 2533; ShowFields: YES; Internal_Part_Number: MCD-00059; Status: Released; Part_Type: Resistor; Alternate_Manufacturer: YAGEO; Package: 0402; ComponentLink1URL: http://tunmcdsvn.tun.st.com/Component_Documentation_Library/Trunk/Resistor/YAGEO_RC_L_Series; Order_Code_Digikey: 311-100KLRTR-ND; Order_Code_Farnell: 2421891; Order_Code_RS: N/A
R209 R273 R279 R281-R283 R286 R287 = MCD-00052: Resistor,0R,0402,5%,1/16W; Manufacturer_Part_Number: RC0402JR-070RL; Manufacturer: YAGEO; Part_Preference: Recommended; Order_Code_RS: 618-5804; ID: 2540; ShowFields: YES; Internal_Part_Number: MCD-00052; Status: Released; Part_Type: Resistor; ComponentLink1Description: Part_Information; ComponentLink1URL: http://tunmcdsvn.tun.st.com/Component_Documentation_Library/Trunk/Resistor/YAGEO_RC_L_Series; Package: 0402; Order_Code_Digikey: 311-0.0JRCT-ND; Order_Code_Farnell: 9232516RL; Alternate_Manufacturer: N/A; Alternate_Manufacturer_Part_Number: N/A
R210 = MCD-02482: Resistor,162K,0402,1%,1/16W; Part_Preference: Recommended; Manufacturer: YAGEO; Manufacturer_Part_Number: RC0402FR-07162KL; ID: 4588; ShowFields: YES; Internal_Part_Number: MCD-02482; Status: Checked; Part_Type: Resistor; Alternate_Manufacturer: N/A; Alternate_Manufacturer_Part_Number: N/A; Package: 0402; ComponentLink1URL: http://tunmcdsvn.tun.st.com/Component_Documentation_Library/Trunk/Resistor/YAGEO_RC_L_Series; Order_Code_Digikey: YAG2370TR-ND; Order_Code_Farnell: N/A; Order_Code_RS: N/A
R211 = MCD-00069: Resistor, 36K, 0402, 1%, 1/16W; Part_Preference: Recommended; Manufacturer: YAGEO; Manufacturer_Part_Number: RC0402FR-0736KL; ID: 2523; ShowFields: YES; Internal_Part_Number: MCD-00069; Status: Released; Part_Type: Resistor; Alternate_Manufacturer: N/A; Alternate_Manufacturer_Part_Number: N/A; Package: 0402; ComponentLink1URL: http://tunmcdsvn.tun.st.com/Component_Documentation_Library/Trunk/Resistor/YAGEO_RC_L_Series; Order_Code_Digikey: 311-36.0KLRCT-ND; Order_Code_Farnell: 1458788; Order_Code_RS: N/A
R276 = MCD-02479: Resistor, 40K2, 0402, +/-1%, 1/16W; Part_Preference: Recommended; Manufacturer: YAGEO; Manufacturer_Part_Number: RC0402FR-0740K2L; ID: 4585; ShowFields: YES; Internal_Part_Number: MCD-02479; Status: Checked; Part_Type: Resistor; Alternate_Manufacturer: N/A; Alternate_Manufacturer_Part_Number: N/A; Package: 0402; ComponentLink1URL: http://tunmcdsvn.tun.st.com/Component_Documentation_Library/Trunk/Resistor/YAGEO_RC_L_Series; Order_Code_Digikey: 311-40.2KLRCT-ND; Order_Code_Farnell: 3495613; Order_Code_RS: N/A
R277 = MCD-01516: Resistor, 5R1, 0402, +/-1%, 1/16W; Part_Preference: Recommended; Manufacturer: YAGEO; Manufacturer_Part_Number: RC0402FR-075R1L; ID: 3616; ShowFields: YES; Internal_Part_Number: MCD-01516; Status: Checked; Part_Type: Resistor; Alternate_Manufacturer: N/A; Alternate_Manufacturer_Part_Number: N/A; Package: 0402; ComponentLink1URL: http://tunmcdsvn.tun.st.com/Component_Documentation_Library/Trunk/Resistor/YAGEO_RC_L_Series; Order_Code_Digikey: YAG3370CT-ND; Order_Code_Farnell: 1458801; Order_Code_RS: N/A
R288 = MCD-02480: Resistor, 33K2, 0402, +/-1%, 1/16W; Part_Preference: Recommended; Manufacturer: YAGEO; Manufacturer_Part_Number: RC0402FR-0733K2L; ID: 4586; ShowFields: YES; Internal_Part_Number: MCD-02480; Status: Checked; Part_Type: Resistor; Alternate_Manufacturer: N/A; Alternate_Manufacturer_Part_Number: N/A; Package: 0402; ComponentLink1URL: http://tunmcdsvn.tun.st.com/Component_Documentation_Library/Trunk/Resistor/YAGEO_RC_L_Series; Order_Code_Digikey: 311-33.2KLRTR-ND; Order_Code_Farnell: 3495596; Order_Code_RS: N/A
R294 = MCD-02481: Resistor, 196K, 0402, +/-1%, 1/16W; Part_Preference: Recommended; Manufacturer: YAGEO; Manufacturer_Part_Number: RC0402FR-07196KL; ID: 4587; ShowFields: YES; Internal_Part_Number: MCD-02481; Status: Checked; Part_Type: Resistor; Alternate_Manufacturer: N/A; Alternate_Manufacturer_Part_Number: N/A; Package: 0402; ComponentLink1URL: http://tunmcdsvn.tun.st.com/Component_Documentation_Library/Trunk/Resistor/YAGEO_RC_L_Series; Order_Code_Digikey: YAG3024TR-ND; Order_Code_Farnell: N/A; Order_Code_RS: N/A
TP13 TP14 TP21 = MCD-00631: Test Point 0.6mm; Part_Type: Misc; Part_Preference: Recommended; ID: 3108; ShowFields: YES; Internal_Part_Number: MCD-00631; Status: Released; ComponentLink1Description: Part_Information; Manufacturer: N/A; Manufacturer_Part_Number: N/A; Order_Code_Digikey: N/A; Order_Code_Farnell: N/A; Order_Code_RS: N/A
TP40 = MCD-00713: Vero Technologies 1.02mm Black Terminal Post; Part_Type: Misc; Manufacturer_Part_Number: 20-2137; Part_Preference: Recommended; Order_Code_RS: 101-2391; ID: 3032; ShowFields: YES; Internal_Part_Number: MCD-00713; Status: Released; Manufacturer: VERO; ComponentLink1URL: http://tunmcdsvn.tun.st.com/Component_Datasheet_Library/Trunk/Misc/Vero_TestPin_20-2137
U2 U30 U37 U39 = MCD-02469: Adjustable Step down converter 3A , output 0.6V to 4V; Part_Type: IC; Part_Preference: Recommended; Manufacturer: TEXAS INSTRUMENTS; Order_Code_RS: NA; ID: 4575; ShowFields: YES; Internal_Part_Number: MCD-02469; Value: TPS62088YFP; Status: Checked; Manufacturer_Part_Number: TPS62088YFP; Alternate_Manufacturer: N/A; Alternate_Manufacturer_Part_Number: N/A; Package: DSBGA; ComponentLink1URL: http://tunmcdsvn.tun.st.com/Component_Documentation_Library/Trunk/IC/TEXAS_INSTRUMENTS_TPS6208812YFP; Order_Code_Digikey: NA; Order_Code_Farnell: NA
U8 = MCD-02219: 3 A DC step-down switching regulator; Part_Preference: Recommended; Part_Type: IC; Manufacturer: STMICROELECTRONICS; Manufacturer_HQ_COO: EU; Order_Code_RS: NA; ID: 4319; ShowFields: YES; Internal_Part_Number: MCD-02219; Status: Checked; Manufacturer_Part_Number: ST1S40IPUR; Package: VFQFPN; ComponentLink1Description: Part_Information; ComponentLink1URL: http://tunmcdsvn.tun.st.com/Component_Datasheet_Library/Trunk/IC/STM_Buck_converter_ST1S40IPUR; Alternate_Manufacturer: N/A; Alternate_Manufacturer_Part_Number: N/A; Order_Code_Digikey: 497-12084-1-ND; Order_Code_Farnell: NA; Value: ST1S40IPUR
U38 = MCD-02369: Complete Power solution for DDR4 , VQFN , 3 x 3 mm; Part_Type: IC; Part_Preference: Recommended; Manufacturer: TEXAS INSTRUMENTS; ID: 4475; ShowFields: YES; ComponentLink1Description: Datasheet; ComponentLink1URL: http://tunmcdsvn.tun.st.com/Component_Documentation_Library/Trunk/IC/TEXAS_INSTRUMENTS_TPS65295RJER/; Internal_Part_Number: MCD-02369; Status: Checked; Manufacturer_Part_Number: TPS65295RJER; Alternate_Manufacturer: N/A; Alternate_Manufacturer_Part_Number: N/A; Package: VQFN; Order_Code_Digikey: 296-TPS65295RJERTR-ND; Order_Code_Farnell: N/A; Order_Code_RS: N/A